# EAGLE design gateway-motherboard (EAGLE 7.2.0)
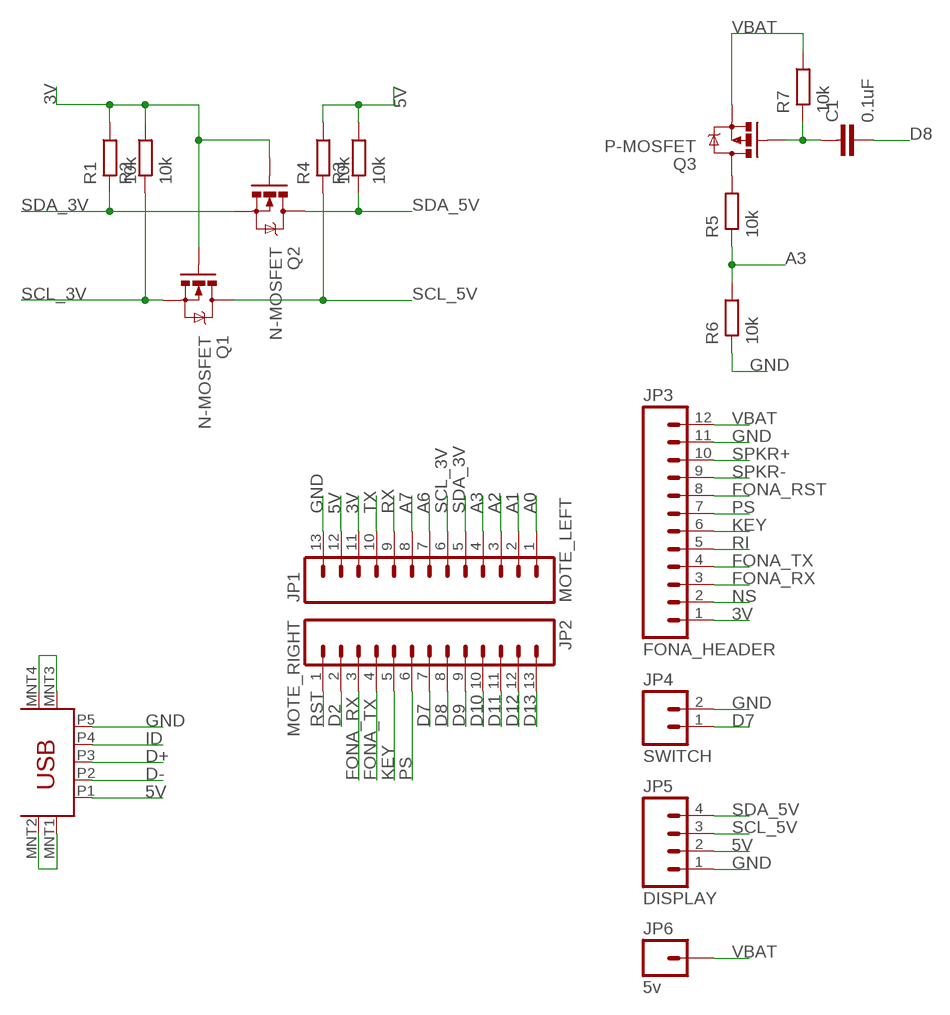
[diagram p0: schematic, sheet 1]

## Parts
C1  0.1uF  CAPACITOR0603-L  [C0603-L]
JP1  MOTE_LEFT  M13LONGPADS  [1X13-LONGPADS]
JP2  MOTE_RIGHT  M13LONGPADS  [1X13-LONGPADS]
JP3  FONA_HEADER  M12LONGPADS  [1X12_LONGPADS]
JP4  SWITCH  M02LOCK_LONGPADS  [1X02_LOCK_LONGPADS]
JP5  DISPLAY  M04LONGPADS  [1X04_LONGPADS]
JP6  5v  M01NOSILK-KIT  [1X01NS-KIT]
Q1  N-MOSFET  MOSFET-NCHANNELBSS138  [SOT23]
Q2  N-MOSFET  MOSFET-NCHANNELBSS138  [SOT23]
Q3  P-MOSFET  MOSFET-PCHANNELIRLML2244  [SOT23-3]
R1  10k  RESISTOR0603-L  [R0603-L]
R2  10k  RESISTOR0603-L  [R0603-L]
R3  10k  RESISTOR0603-L  [R0603-L]
R4  10k  RESISTOR0603-L  [R0603-L]
R5  10k  RESISTOR0603-L  [R0603-L]
R6  10k  RESISTOR0603-L  [R0603-L]
R7  10k  RESISTOR0603-L  [R0603-L]
U$1  USB-MINIB  [USB-MINIB_HOLE_RETENTION]

## Nets
3V: JP1.11 JP3.1 Q1.1(G) Q2.1(G) R1.2 R2.2
5V: JP1.12 JP5.2 R3.2 R4.2 U$1.P1(VBUS)
A0: JP1.1
A1: JP1.2
A2: JP1.3
A3: JP1.4 R5.1 R6.2
A6: JP1.7
A7: JP1.8
D2: JP2.2
D7: JP2.7 JP4.1
D8: C1.2 JP2.8
D9: JP2.9
D10: JP2.10
D11: JP2.11
D12: JP2.12
D13: JP2.13
D+: U$1.P3(D+)
D-: U$1.P2(D-)
FONA_RST: JP3.8
FONA_RX: JP2.3 JP3.3
FONA_TX: JP2.4 JP3.4
GND: JP1.13 JP3.11 JP4.2 JP5.1 R6.1 U$1.MNT1(MTN1) U$1.MNT2(MTN2) U$1.MNT3(MTN3) U$1.MNT4(MTN4) U$1.P5(GND)
ID: U$1.P4(ID)
KEY: JP2.5 JP3.6
N$2: Q3.3(D) R5.2
N$3: C1.1 Q3.1(G) R7.1
NS: JP3.2
PS: JP2.6 JP3.7
RI: JP3.5
RST: JP2.1
RX: JP1.9
SCL_3V: JP1.6 Q1.2(S) R2.1
SCL_5V: JP5.3 Q1.3(D) R4.1
SDA_3V: JP1.5 Q2.2(S) R1.1
SDA_5V: JP5.4 Q2.3(D) R3.1
SPKR+: JP3.10
SPKR-: JP3.9
TX: JP1.10
VBAT: JP3.12 JP6.1 Q3.2(S) R7.2

## Library data of the parts
C1 = passives-7351:CAPACITOR
JP1 JP2 = SparkFun-Connectors:M13: 13-pin single row .1" header
JP3 = SparkFun-Connectors:M12: Header 12 Standard 12-pin 0.1" header. Use with straight break away headers (SKU : PRT-00116), right angle break away headers (PRT-00553), swiss pins (PRT-00743), machine pins (PRT-00117), and female headers (PRT-00115).
JP4 = SparkFun-Connectors:M02: Standard 2-pin 0.1" header. Use with - straight break away headers ( PRT-00116) - right angle break away headers (PRT-00553) - swiss pins (PRT-00743) - machine pins (PRT-00117) - female headers (PRT-00115) Molex polarized connector foot print use with: PRT-08233 with associated crimp pins and housings. 2.54_SCREWTERM for use with PRT-10571. 3.5mm Screw Terminal footprints for PRT-08084 5mm Screw Terminal footprints for use with PRT-08433
JP5 = SparkFun-Connectors:M04: Header 4 Standard 4-pin 0.1" header. Use with straight break away headers (SKU : PRT-00116), right angle break away headers (PRT-00553), swiss pins (PRT-00743), machine pins (PRT-00117), and female headers (PRT-00115). Molex polarized connector foot print use with SKU : PRT-08231 with associated crimp pins and housings. 1MM SMD Version SKU: PRT-10208
JP6 = SparkFun-Connectors:M01: Header 1 Standard 1-pin 0.1" header. Use with straight break away headers (SKU : PRT-00116), right angle break away headers (PRT-00553), swiss pins (PRT-00743), machine pins (PRT-00117), and female headers (PRT-00115).
Q1 Q2 = SparkFun-DiscreteSemi:MOSFET-NCHANNEL: Common NMOSFET Parts MFG P/N Store ID Prod ID FDD8780 TRANS-09984 SI7820DN TRANS-11055 FDS6630A IC-08089 2N7002PW TRANS-11151 FQP30N06L COM-10213 TRANS-10060 BSS123LT1G TRANS-08345 BSS138 TRANS-00830 BS170 2N7000; PROD_ID: TRANS-00830
Q3 = SparkFun-DiscreteSemi:MOSFET-PCHANNEL: Generic PMOSFET; PROD_ID: TRANS-11153
R1-R7 = passives-7351:RESISTOR
U$1 = myRandomThings:USB-MINIB: Mini-USB "B" connector with 5th pin broken out. Created new symbol breaking out 5th "ID" pin in mini/micro USB connector spec. See: http://en.wikipedia.org/wiki/Mini_usb#Cables. Uses same footprint as 4-pin symbol. Also added pins to connect to mounting / shield pads if required (probably not generally needed as signals aren't shielded once they leave the connector).

## Board
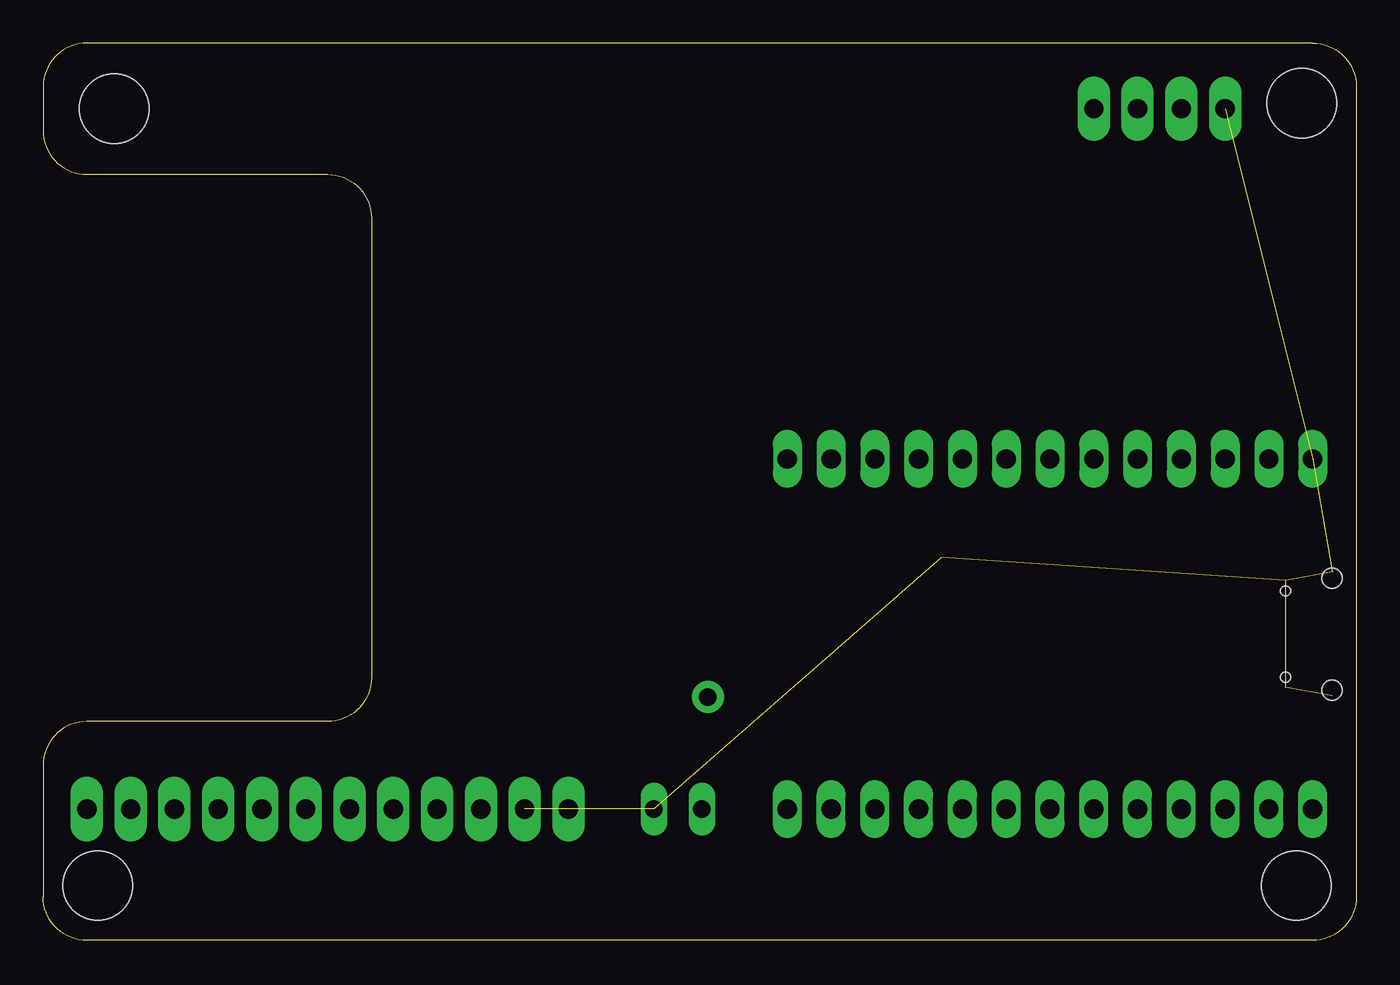
[diagram p1: board, top side]
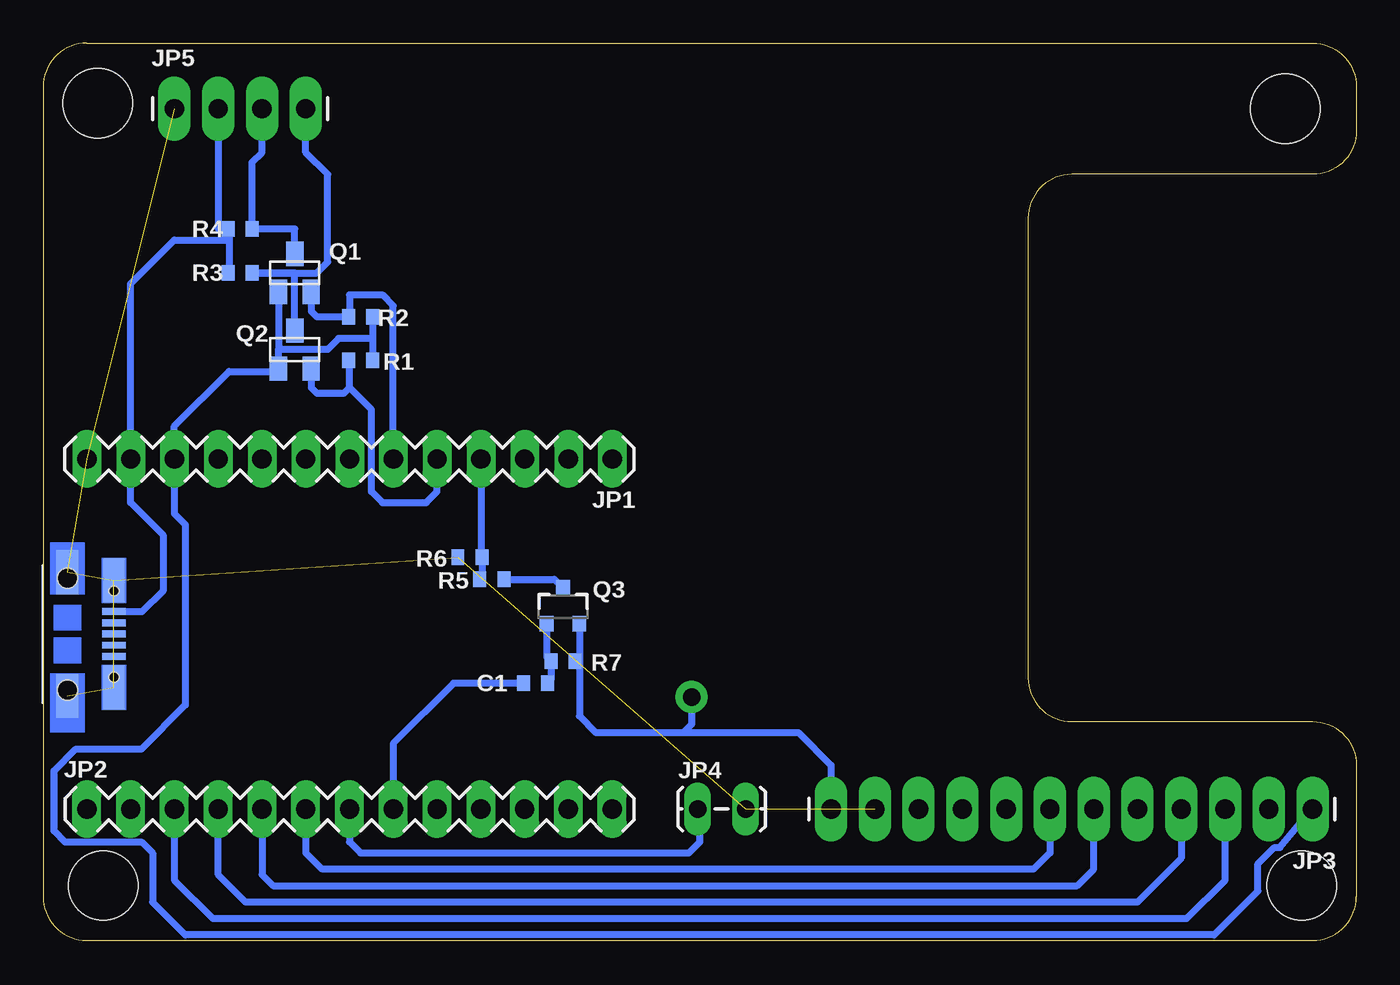
[diagram p2: board, bottom side, seen from below]

Size 76.2 x 52.07 mm. Coordinates in mm from the lower left corner, seen from the top.
Outline: 73.66,52.07 2.54,52.07 arc90 0,49.53 0,46.99 arc90 2.54,44.45 16.51,44.45 arc-90 19.05,41.91 19.05,15.24 arc-90 16.51,12.7 2.54,12.7 arc90 0,10.16 0,2.54 arc90 2.54,0 73.66,0 arc90 76.2,2.54 76.2,49.53 arc90 73.66,52.07
Copper layers (1*16): Top 0.035mm / dielectric 1.5mm / Bottom 0.035mm
Design rules "default": minimum track width 10mil, minimum drill 24mil, track to track 8mil, track to pad 8mil, pad to pad 8mil, via to via 8mil, smd to smd 8mil, copper to edge 40mil, drill to drill 8mil, minimum pad ring 10mil, minimum via ring 8mil, stop-mask expansion 4mil, vias tented up to drill 0mil, thermal gap 10mil
Holes 4 mm at 4.13,48.26 73.03,48.58 72.71,3.17 3.17,3.17

### Footprints (pad centres in the part's own frame; a part is rotated, then mirrored left to right if it is on the bottom)
C0603-L = smd 0.75 x 0.9: 1 -0.7,0; 2 0.7,0
1X13-LONGPADS = drill 1.118 long: 1 0,0; 2 2.54,0; 3 5.08,0; 4 7.62,0; 5 10.16,0; 6 12.7,0; 7 15.24,0; 8 17.78,0; 9 20.32,0; 10 22.86,0; 11 25.4,0; 12 27.94,0; 13 30.48,0
1X12_LONGPADS = drill 1.118 pad 1.88 long: 1 0,0; 2 2.54,0; 3 5.08,0; 4 7.62,0; 5 10.16,0; 6 12.7,0; 7 15.24,0; 8 17.78,0; 9 20.32,0; 10 22.86,0; 11 25.4,0; 12 27.94,0
1X02_LOCK_LONGPADS = drill 1.016 long: 1 -0.127,0; 2 2.667,0
1X04_LONGPADS = drill 1.118 pad 1.88 long: 1 0,0; 2 2.54,0; 3 5.08,0; 4 7.62,0
1X01NS-KIT = drill 1.016 pad 1.88: 1 0,0
SOT23 = smd 1 x 1.4: 1 -0.95,-1.1; 2 0.95,-1.1; 3 0,1.1
SOT23-3 = smd 0.8 x 0.9: 1 -0.95,-1; 2 0.95,-1; 3 0,1.1
R0603-L = smd 0.75 x 0.9: 1 -0.7,0; 2 0.7,0
USB-MINIB_HOLE_RETENTION = smd 2.54 x 1.27: MNT1 -3.1,2.7; MNT2 3.1,2.7; MNT3 -3.6,0; MNT4 3.6,0 | smd 0.4 x 1.35: P1 -1.3,2.7; P2 -0.65,2.7; P3 0,2.7; P4 0.65,2.7; P5 1.3,2.7 | hole 0.55: 2.5,2.7; -2.5,2.7 | hole 1.15: -3.25,0; 3.25,0

### Placement (x,y rotation side)
C1  47.62,14.92 180 bottom
JP1  43.18,27.94 180 bottom
JP2  73.66,7.62 0 bottom
JP3  2.54,7.62 180 bottom
JP4  38.1,7.62 0 bottom
JP5  68.58,48.26 0 bottom
JP6  38.58,14.13 0 bottom
Q1  61.59,38.73 0 bottom
Q2  61.59,34.29 0 bottom
Q3  46.04,19.37 0 bottom
R1  57.78,33.66 0 bottom
R2  57.78,36.2 0 bottom
R3  64.77,38.73 180 bottom
R4  64.77,41.27 180 bottom
R5  50.16,20.95 0 bottom
R6  51.44,22.23 0 bottom
R7  46.04,16.19 0 bottom
U$1  74.79,17.78 270 bottom

### Tracks (layer width: path | path; a pad name or v marks a point on that pad's centre or on a via)
3V
  Bottom 0.406: Q2.1 62.55,34.29 | Q1.1 62.55,34.29 | 62.55,34.29 59.69,34.29 59.05,34.92 57.15,34.92 57.09,34.99 R2.2 R1.2 | Q2.1 62.55,32.7 | Q2.1 62.72,33.02 65.41,33.02 68.58,29.84 JP1.11 68.58,24.77 67.94,24.13 67.94,13.65 70.48,11.11 74.3,11.11 75.56,9.84 75.56,6.35 74.93,5.71 70.48,5.71 69.85,5.08 69.85,2.22 67.94,0.32 8.26,0.32 5.71,2.86 5.71,4.45 4.76,5.4 4.45,5.4 2.86,7.3 JP3.1
5V
  Bottom 0.406: U$1.P1 70.45,19.08 69.22,20.32 69.22,23.5 71.12,25.4 JP1.12 71.12,38.1 68.58,40.64 65.41,40.64 | 65.41,40.64 65.41,41.21 R4.2 66.04,41.27 JP5.2 | 65.41,40.64 65.41,38.8 R3.2
A3
  Bottom 0.406: JP1.4 50.8,22.29 R6.2 50.73,21.09 R5.1
D7
  Bottom 0.406: JP2.7 58.42,5.71 57.78,5.08 38.73,5.08 38.1,5.71 38.1,7.49 JP4.1
D8
  Bottom 0.406: C1.2 52.39,14.92 55.88,11.43 JP2.8
FONA_RX
  Bottom 0.406: JP2.3 68.58,3.49 66.36,1.27 9.84,1.27 7.62,3.49 JP3.3
FONA_TX
  Bottom 0.406: JP3.4 10.16,4.76 12.7,2.22 64.45,2.22 66.04,3.81 JP2.4
GND  (9 unrouted)
KEY
  Bottom 0.406: JP2.5 63.5,3.81 62.87,3.17 16.19,3.17 15.24,4.13 JP3.6
N$2
  Bottom 0.406: R5.2 46.52,20.95 Q3.3
N$3
  Bottom 0.406: Q3.1 46.99,16.44 R7.1 46.74,15.11 C1.1
PS
  Bottom 0.406: JP3.7 17.78,5.08 18.73,4.13 60.01,4.13 60.96,5.08 JP2.6
SCL_3V
  Bottom 0.406: Q1.2 60.65,36.52 60.33,36.2 R2.1 58.42,36.26 58.42,37.47 56.52,37.47 55.88,36.83 JP1.6
SCL_5V
  Bottom 0.406: Q1.3 61.59,41.27 R4.1 64.07,45.15 63.5,45.72 JP5.3
SDA_3V
  Bottom 0.406: JP1.5 53.34,26.04 53.98,25.4 56.52,25.4 57.15,26.04 57.15,30.8 58.42,32.07 | Q2.2 60.65,32.07 60.33,31.75 58.74,31.75 58.42,32.07 | 58.42,32.07 58.42,33.59 R1.1
SDA_5V
  Bottom 0.406: Q2.3 61.59,38.73 R3.1 60.33,38.73 59.69,39.37 59.69,44.45 60.96,45.72 JP5.4
VBAT
  Bottom 0.406: Q3.2 45.09,16.44 | 45.09,16.44 R7.2 | 45.09,16.44 45.09,13.02 44.13,12.06 39.05,12.06 | 39.05,12.06 32.38,12.06 30.48,10.16 JP3.12 | JP6.1 38.58,12.54 39.05,12.06